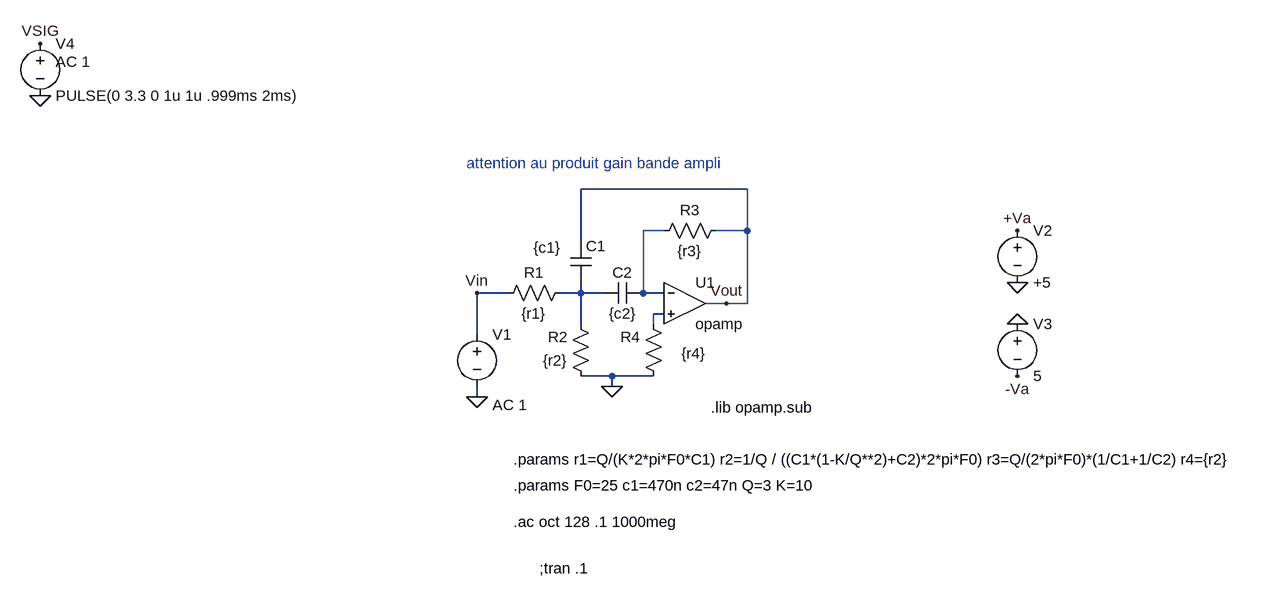
[diagram p0: schematic pband-rauch.asc]
pband-rauch.asc, the LTspice schematic file:
Version 4
SHEET 1 1224 680
WIRE 272 -32 16 -32
WIRE 144 32 112 32
WIRE 272 32 272 -32
WIRE 272 32 224 32
WIRE 16 48 16 -32
WIRE -96 128 -144 128
WIRE 16 128 16 112
WIRE 16 128 -16 128
WIRE 48 128 16 128
WIRE 112 128 112 32
WIRE 144 128 112 128
WIRE 240 144 208 144
WIRE 272 144 272 32
WIRE 272 144 240 144
WIRE 144 160 128 160
WIRE 16 176 16 128
WIRE 128 176 128 160
WIRE -144 192 -144 128
WIRE 64 256 16 256
WIRE 128 256 64 256
WIRE 64 272 64 256
WIRE -144 288 -144 272
FLAG 64 272 0
FLAG -144 288 0
FLAG 688 112 0
FLAG 688 176 0
FLAG 688 32 +Va
FLAG 688 256 -Va
FLAG -816 -176 0
FLAG -816 -256 VSIG
FLAG -144 128 Vin
FLAG 240 144 Vout
SYMBOL res 0 112 R90
WINDOW 0 0 56 VBottom 2
WINDOW 3 32 56 VTop 2
SYMATTR InstName R1
SYMATTR Value {r1}
SYMBOL res 32 272 R180
WINDOW 0 36 76 Left 2
WINDOW 3 36 40 Left 2
SYMATTR InstName R2
SYMATTR Value {r2}
SYMBOL res 128 48 R270
WINDOW 0 32 56 VTop 2
WINDOW 3 0 56 VBottom 2
SYMATTR InstName R3
SYMATTR Value {r3}
SYMBOL res 144 272 R180
WINDOW 0 36 76 Left 2
WINDOW 3 -65 51 Left 2
SYMATTR InstName R4
SYMATTR Value {r4}
SYMBOL cap 0 48 R0
WINDOW 3 -57 10 Left 2
SYMATTR Value {c1}
SYMATTR InstName C1
SYMBOL cap 112 112 R90
WINDOW 0 0 32 VBottom 2
WINDOW 3 32 32 VTop 2
SYMATTR InstName C2
SYMATTR Value {c2}
SYMBOL voltage -144 176 R0
WINDOW 123 24 124 Left 2
WINDOW 39 0 0 Left 2
SYMATTR Value2 AC 1
SYMATTR InstName V1
SYMATTR Value ""
SYMBOL voltage 688 16 R0
WINDOW 123 0 0 Left 2
WINDOW 39 0 0 Left 2
SYMATTR InstName V2
SYMATTR Value +5
SYMBOL voltage 688 160 R0
WINDOW 123 0 0 Left 2
WINDOW 39 0 0 Left 2
SYMATTR InstName V3
SYMATTR Value 5
SYMBOL voltage -816 -272 R0
WINDOW 123 24 44 Left 2
WINDOW 39 0 0 Left 2
SYMATTR Value2 AC 1
SYMATTR InstName V4
SYMATTR Value PULSE(0 3.3 0 1u 1u .999ms 2ms)
SYMBOL Opamps\\opamp 176 80 R0
SYMATTR InstName U1
SYMATTR SpiceLine2 GBW=100Meg
TEXT 216 304 Left 2 !.lib opamp.sub
TEXT -88 384 Left 2 !.params r1=Q/(K*2*pi*F0*C1) r2=1/Q / ((C1*(1-K/Q**2)+C2)*2*pi*F0) r3=Q/(2*pi*F0)*(1/C1+1/C2) r4={r2}
TEXT -88 424 Left 2 !.params F0=25 c1=470n c2=47n Q=3 K=10
TEXT -88 480 Left 2 !.ac oct 128 .1 1000meg
TEXT -48 552 Left 2 !;tran .1
TEXT -160 -72 Left 2 ;attention au produit gain bande ampli

The netlist it stands for:
* pband-rauch.asc
R1 N002 Vin {r1}
R2 0 N002 {r2}
R3 N001 Vout {r3}
R4 0 N003 {r4}
C1 Vout N002 {c1}
C2 N001 N002 {c2}
V1 Vin 0 AC 1
V2 +Va 0 +5
V3 0 -Va 5
V4 VSIG 0 PULSE(0 3.3 0 1u 1u .999ms 2ms) AC 1
XU1 N001 N003 Vout opamp Aol=100K GBW=100Meg  ; pins invin noninvin out
.lib opamp.sub
.params r1=Q/(K*2*pi*F0*C1) r2=1/Q / ((C1*(1-K/Q**2)+C2)*2*pi*F0) r3=Q/(2*pi*F0)*(1/C1+1/C2) r4={r2}
.params F0=25 c1=470n c2=47n Q=3 K=10
.ac oct 128 .1 1000meg
;tran .1
* attention au produit gain bande ampli
.backanno
.end